# EAGLE design HD44780_BusCard (EAGLE 6.5.0)
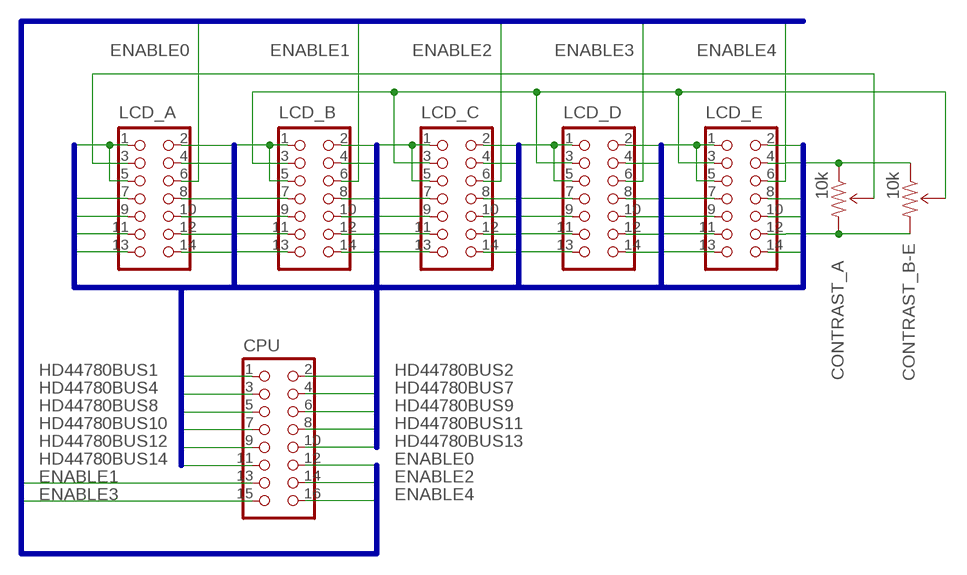
[diagram p0: schematic, sheet 1]

## Parts
CONTRAST_A  10k  TRIMPOT-PTH-KNOB  [3386U]
CONTRAST_B-E  10k  TRIMPOT-PTH-KNOB  [3386U]
CPU  CON_HEADER_2X08SHROUDED  [PINSHRD_PTH_2X08]
LCD_A  CON_HEADER_2X07-PTH-SHROUDED  [PINSHRD_PTH_2X07]
LCD_B  CON_HEADER_2X07-PTH-SHROUDED  [PINSHRD_PTH_2X07]
LCD_C  CON_HEADER_2X07-PTH-SHROUDED  [PINSHRD_PTH_2X07]
LCD_D  CON_HEADER_2X07-PTH-SHROUDED  [PINSHRD_PTH_2X07]
LCD_E  CON_HEADER_2X07-PTH-SHROUDED  [PINSHRD_PTH_2X07]

## Nets
ENABLE0: CPU.12 LCD_A.6
ENABLE1: CPU.13 LCD_B.6
ENABLE2: CPU.14 LCD_C.6
ENABLE3: CPU.15 LCD_D.6
ENABLE4: CPU.16 LCD_E.6
HD44780BUS1: CONTRAST_A.1(CCW) CONTRAST_B-E.1(CCW) CPU.1 LCD_A.1 LCD_A.5 LCD_B.1 LCD_B.5 LCD_C.1 LCD_C.5 LCD_D.1 LCD_D.5 LCD_E.1 LCD_E.5
HD44780BUS2: CONTRAST_A.3(CW) CONTRAST_B-E.3(CW) CPU.2 LCD_A.2 LCD_B.2 LCD_C.2 LCD_D.2 LCD_E.2
HD44780BUS4: CPU.3 LCD_A.4 LCD_B.4 LCD_C.4 LCD_D.4 LCD_E.4
HD44780BUS7: CPU.4 LCD_A.7 LCD_B.7 LCD_C.7 LCD_D.7 LCD_E.7
HD44780BUS8: CPU.5 LCD_A.8 LCD_B.8 LCD_C.8 LCD_D.8 LCD_E.8
HD44780BUS9: CPU.6 LCD_A.9 LCD_B.9 LCD_C.9 LCD_D.9 LCD_E.9
HD44780BUS10: CPU.7 LCD_A.10 LCD_B.10 LCD_C.10 LCD_D.10 LCD_E.10
HD44780BUS11: CPU.8 LCD_A.11 LCD_B.11 LCD_C.11 LCD_D.11 LCD_E.11
HD44780BUS12: CPU.9 LCD_A.12 LCD_B.12 LCD_C.12 LCD_D.12 LCD_E.12
HD44780BUS13: CPU.10 LCD_A.13 LCD_B.13 LCD_C.13 LCD_D.13 LCD_E.13
HD44780BUS14: CPU.11 LCD_A.14 LCD_B.14 LCD_C.14 LCD_D.14 LCD_E.14
N$1: CONTRAST_A.2(WIPER) LCD_A.3
N$2: CONTRAST_B-E.2(WIPER) LCD_B.3 LCD_C.3 LCD_D.3 LCD_E.3

## Buses
HD44780BUS[1..14]
ENABLE[0..4]

## Library data of the parts
CONTRAST_A CONTRAST_B-E = SparkFun-Electromechanical:TRIMPOT: Various small potentiometers for "set-and-forget" applications
CPU = dp_devices:CON_HEADER_2X08
LCD_A LCD_B LCD_C LCD_D LCD_E = dp_devices:CON_HEADER_2X07: 2x07 pin header

## Board
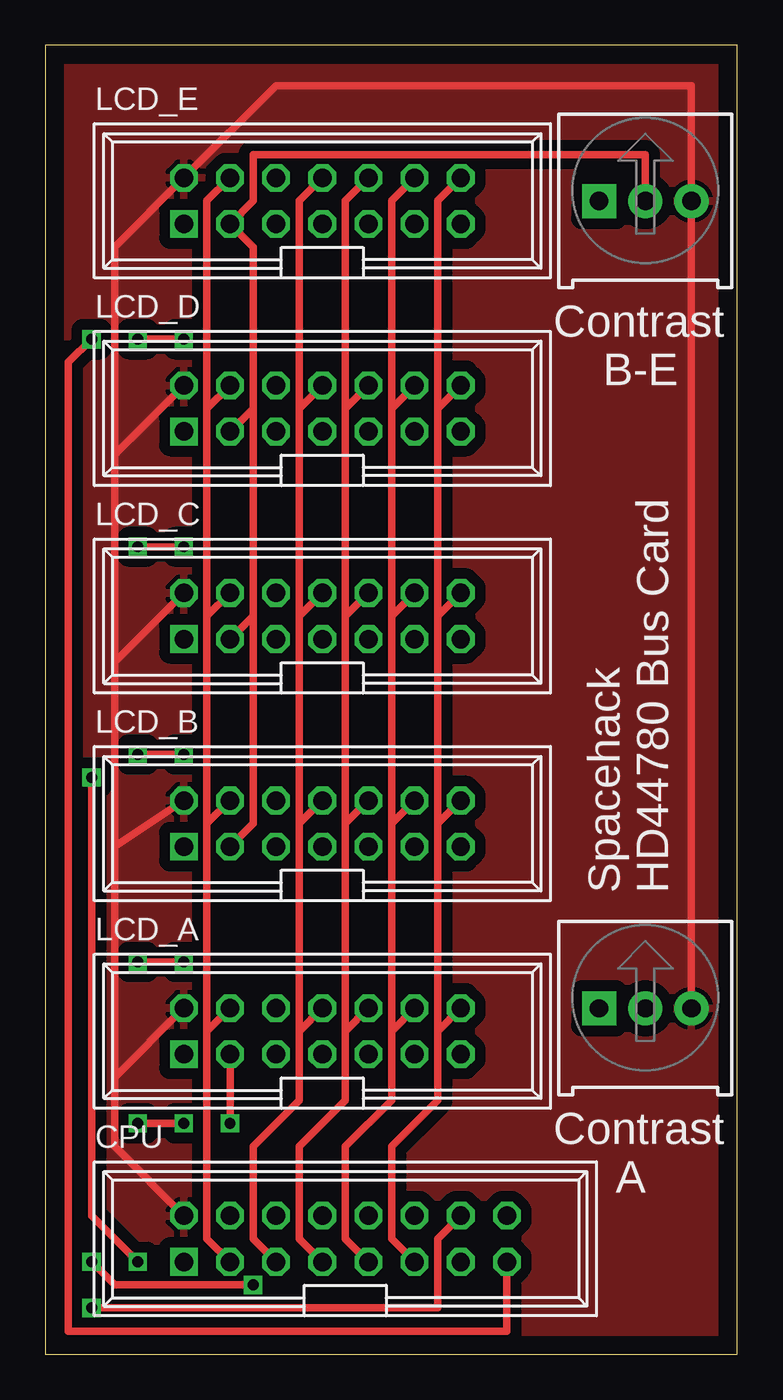
[diagram p1: board, top side]
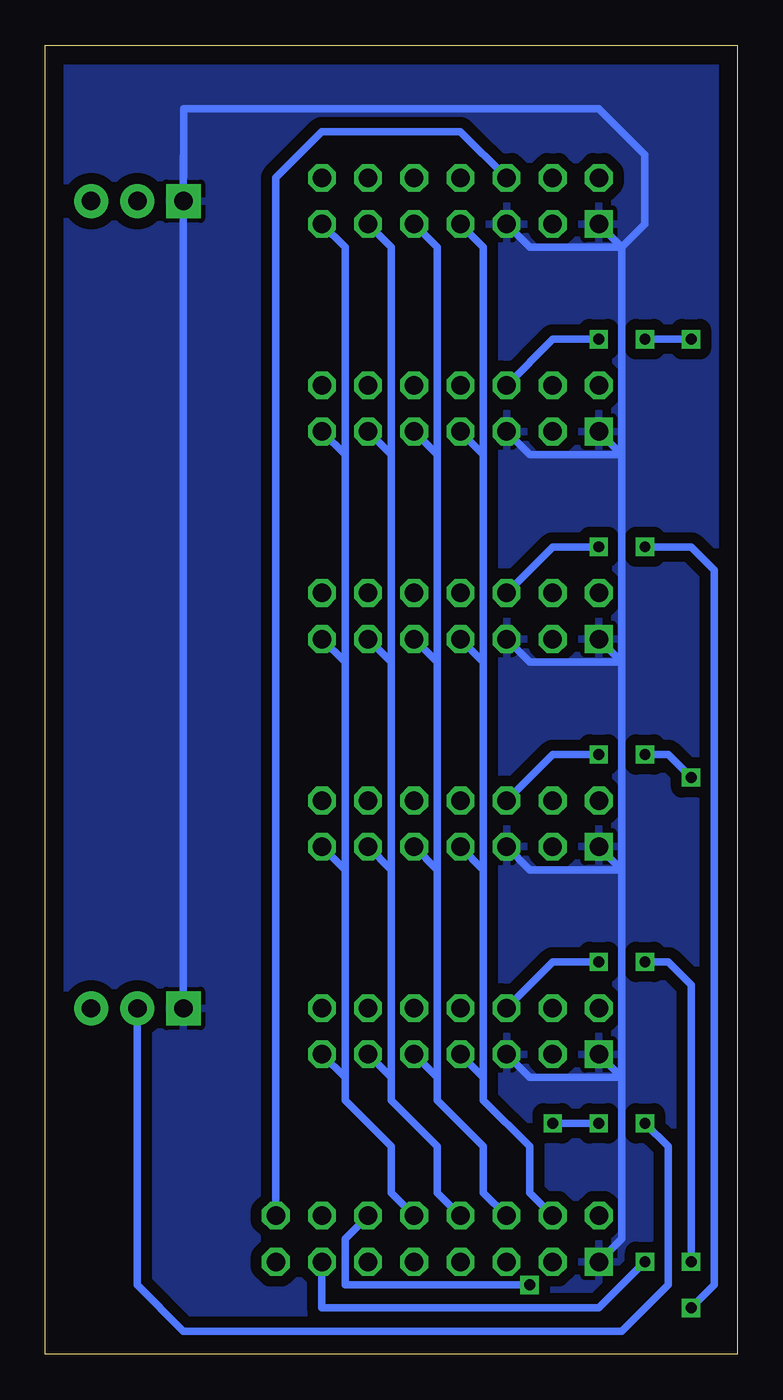
[diagram p2: board, bottom side, seen from below]

Size 38.08 x 72.06 mm. Coordinates in mm from the lower left corner, seen from the top.
Outline: 0,0 38.08,0 38.08,72.06 0,72.06 0,0
Copper layers (1*16): Top 0.035mm / dielectric 1.5mm / Bottom 0.035mm
Design rules "default": minimum track width 10mil, minimum drill 24mil, track to track 8mil, track to pad 8mil, pad to pad 8mil, via to via 8mil, smd to smd 8mil, copper to edge 40mil, drill to drill 8mil, minimum pad ring 10mil, minimum via ring 8mil, stop-mask expansion 4mil, vias tented up to drill 0mil, thermal gap 10mil

### Footprints (pad centres in the part's own frame; a part is rotated, then mirrored left to right if it is on the bottom)
3386U = drill 1.016 pad 1.88 square: 1 -2.54,-0.015 | drill 1.016 pad 1.88: 2 0,-0.015; 3 2.54,-0.015
PINSHRD_PTH_2X08 = drill 1.016 square: 1 -7.62,-1.27 | drill 1.016 octagon: 2 -7.62,1.27; 3 -5.08,-1.27; 4 -5.08,1.27; 5 -2.54,-1.27; 6 -2.54,1.27; 7 0,-1.27; 8 0,1.27; 9 2.54,-1.27; 10 2.54,1.27; 11 5.08,-1.27; 12 5.08,1.27; 13 7.62,-1.27; 14 7.62,1.27; 15 10.16,-1.27; 16 10.16,1.27
PINSHRD_PTH_2X07 = drill 1.016 square: 1 -7.62,-1.27 | drill 1.016 octagon: 2 -7.62,1.27; 3 -5.08,-1.27; 4 -5.08,1.27; 5 -2.54,-1.27; 6 -2.54,1.27; 7 0,-1.27; 8 0,1.27; 9 2.54,-1.27; 10 2.54,1.27; 11 5.08,-1.27; 12 5.08,1.27; 13 7.62,-1.27; 14 7.62,1.27

### Placement (x,y rotation side)
CONTRAST_A  33.02,19.05 0 top
CONTRAST_B-E  33.02,63.5 0 top
CPU  15.24,6.35 0 top
LCD_A  15.24,17.78 0 top
LCD_B  15.24,29.21 0 top
LCD_C  15.24,40.64 0 top
LCD_D  15.24,52.07 0 top
LCD_E  15.24,63.5 0 top

### Tracks (layer width: path | path; a pad name or v marks a point on that pad's centre or on a via)
ENABLE0  (via drill 0.6)
  Top 0.406: v7.62,21.59 v5.08,21.59 | v11.43,3.81 3.81,3.81 v2.54,5.08
  Bottom 0.406: LCD_A.6 10.16,21.59 v7.62,21.59 | v5.08,21.59 3.81,21.59 2.54,20.32 v2.54,5.08 | CPU.12 21.59,6.35 21.59,3.81 v11.43,3.81
ENABLE1  (via drill 0.6)
  Top 0.406: v7.62,33.02 v5.08,33.02 | v5.08,5.08 2.54,7.62 v2.54,31.75
  Bottom 0.406: LCD_B.6 10.16,33.02 v7.62,33.02 | v5.08,33.02 3.81,33.02 v2.54,31.75 | CPU.13 22.86,2.54 7.62,2.54 v5.08,5.08
ENABLE2  (via drill 0.6)
  Top 0.406: v7.62,44.45 v5.08,44.45 | v2.54,2.54 21.59,2.54 21.59,6.35 CPU.14
  Bottom 0.406: LCD_C.6 10.16,44.45 v7.62,44.45 | v5.08,44.45 2.54,44.45 1.27,43.18 1.27,3.81 v2.54,2.54
ENABLE3  (via drill 0.6)
  Top 0.406: v7.62,55.88 v5.08,55.88 | v2.54,55.88 1.27,54.61 1.27,1.27 25.4,1.27 CPU.15
  Bottom 0.406: LCD_D.6 10.16,55.88 v7.62,55.88 | v5.08,55.88 v2.54,55.88
ENABLE4
  Bottom 0.406: LCD_E.6 15.24,67.31 22.86,67.31 25.4,64.77 CPU.16
HD44780BUS1
  Bottom 0.406: CPU.1 6.35,6.35 6.35,15.24 | 6.35,15.24 6.35,26.67 | 6.35,26.67 6.35,38.1 | 6.35,38.1 6.35,49.53 | 6.35,49.53 6.35,60.96 | 6.35,60.96 LCD_E.1 | LCD_D.1 6.35,49.53 | LCD_C.1 6.35,38.1 | LCD_B.1 6.35,26.67 | LCD_A.1 6.35,15.24 | LCD_A.5 11.43,15.24 6.35,15.24 | LCD_B.5 11.43,26.67 6.35,26.67 | LCD_C.5 11.43,38.1 6.35,38.1 | LCD_D.5 11.43,49.53 6.35,49.53 | LCD_E.5 11.43,60.96 6.35,60.96 | CONTRAST_B-E.1 30.46,68.58 | 30.46,68.58 7.62,68.58 5.08,66.04 5.08,62.23 6.35,60.96 | CONTRAST_A.1 30.48,60.96 30.46,68.58
  pour Bottom (isolate 0.61): 0,0 38.1,0 38.1,71.12 0,71.12
HD44780BUS2
  Top 0.406: CPU.2 3.81,11.43 3.81,15.24 | 3.81,15.24 3.81,27.94 | 3.81,27.94 3.81,38.1 | 3.81,38.1 3.81,49.53 | 3.81,49.53 3.81,60.96 LCD_E.2 12.7,69.85 35.56,69.85 35.56,54.61 | LCD_D.2 3.81,49.53 | LCD_C.2 3.81,38.1 | LCD_B.2 3.81,27.94 | LCD_A.2 3.81,15.24 | CONTRAST_B-E.3 35.55,59.69 35.56,54.61 | CONTRAST_A.3 35.56,54.61
  pour Top (isolate 0.61): 0,0 38.1,0 38.1,71.12 0,71.12
HD44780BUS4
  Top 0.406: CPU.3 8.89,6.35 8.89,17.78 | 8.89,17.78 8.89,29.21 | 8.89,29.21 8.89,40.64 | 8.89,40.64 8.89,52.07 | 8.89,52.07 8.89,63.5 LCD_E.4 | LCD_D.4 8.89,52.07 | LCD_C.4 8.89,40.64 | LCD_B.4 8.89,29.21 | LCD_A.4 8.89,17.78
HD44780BUS7
  Bottom 0.406: LCD_E.7 13.97,60.96 13.97,49.53 | 13.97,49.53 13.97,38.1 | 13.97,38.1 13.97,26.67 | 13.97,26.67 13.97,15.24 | 13.97,15.24 13.97,13.97 11.43,11.43 11.43,8.89 CPU.4 | LCD_A.7 13.97,15.24 | LCD_B.7 13.97,26.67 | LCD_C.7 13.97,38.1 | LCD_D.7 13.97,49.53
HD44780BUS8
  Top 0.406: LCD_E.8 13.97,63.5 13.97,52.07 | 13.97,52.07 13.97,40.64 | 13.97,40.64 13.97,29.21 | 13.97,29.21 13.97,17.78 | LCD_A.8 13.97,17.78 | LCD_B.8 13.97,29.21 | LCD_C.8 13.97,40.64 | LCD_D.8 13.97,52.07 | 13.97,17.78 13.97,13.97 11.43,11.43 11.43,6.35 CPU.5
HD44780BUS9
  Bottom 0.406: CPU.6 13.97,8.89 13.97,11.43 16.51,13.97 16.51,15.24 | 16.51,15.24 16.51,26.67 | 16.51,26.67 16.51,38.1 | 16.51,38.1 16.51,49.53 | 16.51,49.53 16.51,60.96 LCD_E.9 | LCD_D.9 16.51,49.53 | LCD_C.9 16.51,38.1 | LCD_B.9 16.51,26.67 | LCD_A.9 16.51,15.24
HD44780BUS10
  Top 0.406: LCD_E.10 16.51,63.5 16.51,52.07 | 16.51,52.07 16.51,40.64 | 16.51,40.64 16.51,29.21 | 16.51,29.21 16.51,17.78 | 16.51,17.78 16.51,13.97 13.97,11.43 13.97,6.35 CPU.7 | LCD_A.10 16.51,17.78 | LCD_B.10 16.51,29.21 | LCD_C.10 16.51,40.64 | LCD_D.10 16.51,52.07
HD44780BUS11
  Bottom 0.406: CPU.8 16.51,8.89 16.51,11.43 19.05,13.97 19.05,15.24 | 19.05,15.24 19.05,26.67 | 19.05,26.67 19.05,38.1 | 19.05,38.1 19.05,49.53 | 19.05,49.53 19.05,60.96 LCD_E.11 | LCD_D.11 19.05,49.53 | LCD_C.11 19.05,38.1 | LCD_B.11 19.05,26.67 | LCD_A.11 19.05,15.24
HD44780BUS12
  Top 0.406: CPU.9 16.51,6.35 16.51,11.43 19.05,13.97 19.05,17.78 | 19.05,17.78 19.05,29.21 | 19.05,29.21 19.05,40.64 | 19.05,40.64 19.05,52.07 | 19.05,52.07 19.05,63.5 LCD_E.12 | LCD_D.12 19.05,52.07 | LCD_C.12 19.05,40.64 | LCD_B.12 19.05,29.21 | LCD_A.12 19.05,17.78
HD44780BUS13
  Bottom 0.406: CPU.10 19.05,8.89 19.05,11.43 21.59,13.97 21.59,15.24 | 21.59,15.24 21.59,26.67 | 21.59,26.67 21.59,38.1 | 21.59,38.1 21.59,49.53 | 21.59,49.53 21.59,60.96 LCD_E.13 | LCD_D.13 21.59,49.53 | LCD_C.13 21.59,38.1 | LCD_B.13 21.59,26.67 | LCD_A.13 21.59,15.24
HD44780BUS14
  Top 0.406: LCD_E.14 21.59,63.5 21.59,52.07 | 21.59,52.07 21.59,40.64 | 21.59,40.64 21.59,29.21 | 21.59,29.21 21.59,17.78 | 21.59,17.78 21.59,13.97 19.05,11.43 19.05,6.35 CPU.11 | LCD_D.14 21.59,52.07 | LCD_C.14 21.59,40.64 | LCD_B.14 21.59,29.21 | LCD_A.14 21.59,17.78
N$1  (via drill 0.6)
  Top 0.406: v5.08,12.7 v7.62,12.7 | v10.16,12.7 LCD_A.3
  Bottom 0.406: CONTRAST_A.2 33.02,3.81 30.48,1.27 6.35,1.27 3.81,3.81 3.81,11.43 v5.08,12.7 | v7.62,12.7 v10.16,12.7
N$2
  Top 0.406: 11.43,52.07 11.43,60.96 LCD_E.3 11.43,63.5 11.43,66.04 33.02,66.04 CONTRAST_B-E.2 | 11.43,52.07 11.43,40.64 | 11.43,40.64 11.43,29.21 LCD_B.3 | LCD_C.3 11.43,40.64 | LCD_D.3 11.43,52.07

### Text on the board
tNames: Contrast / B-E | Spacehack / HD44780 Bus Card | Contrast / A